# Altium project 20K Control Board V1.1.PrjPCB (part 3 of 6)

## Sheet Driver.SchDoc
size A2
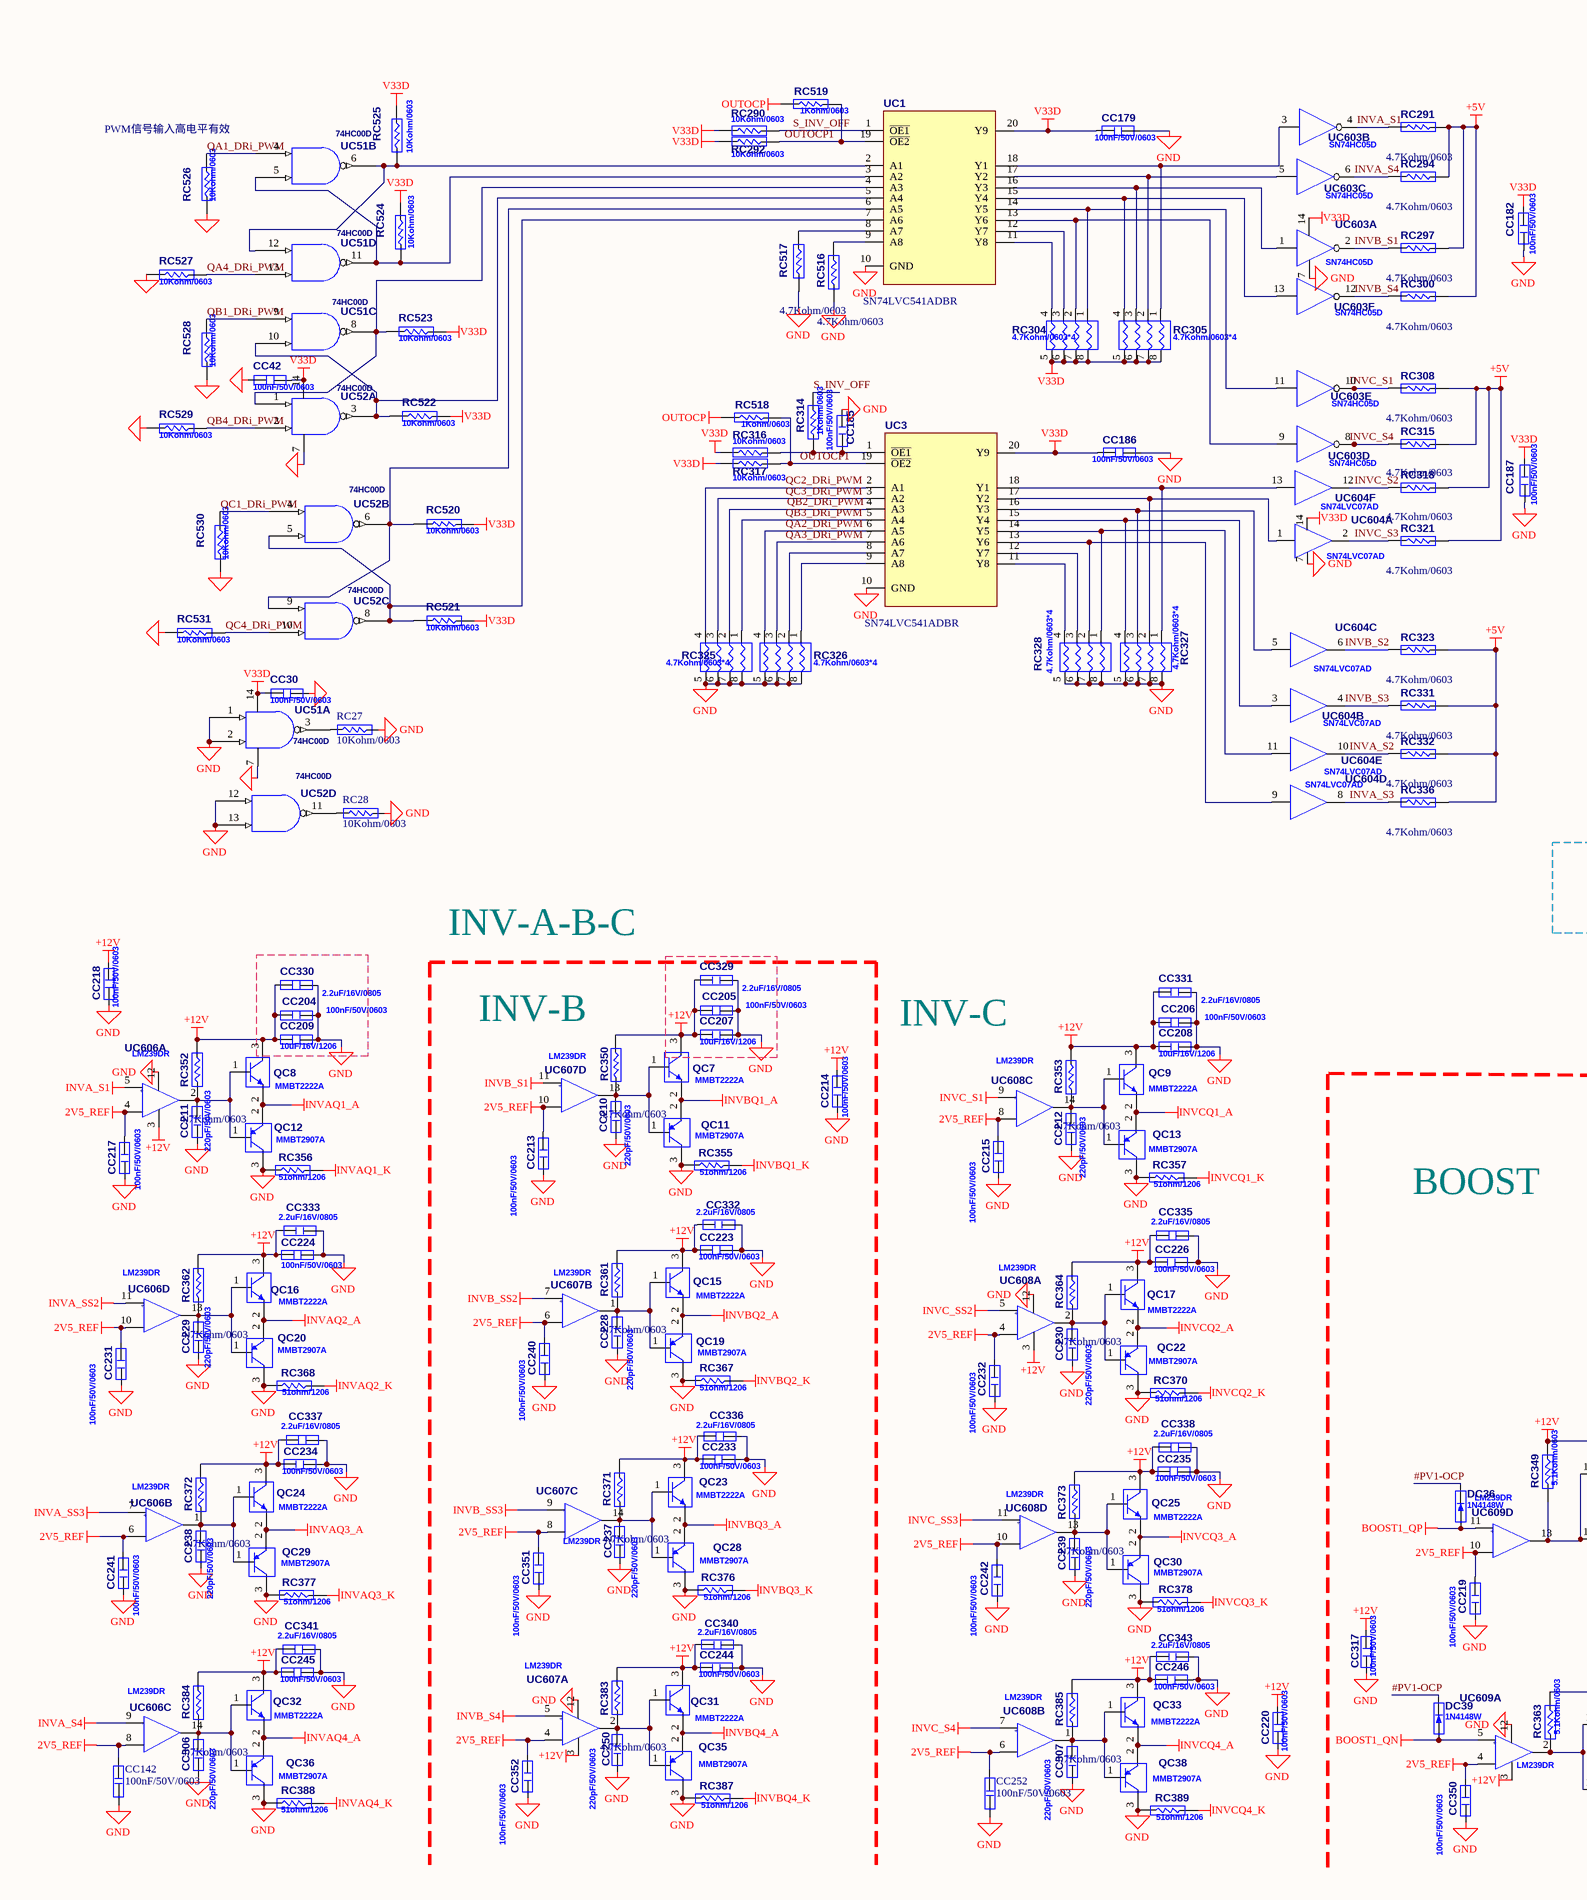
[diagram p3: Driver.SchDoc, left]
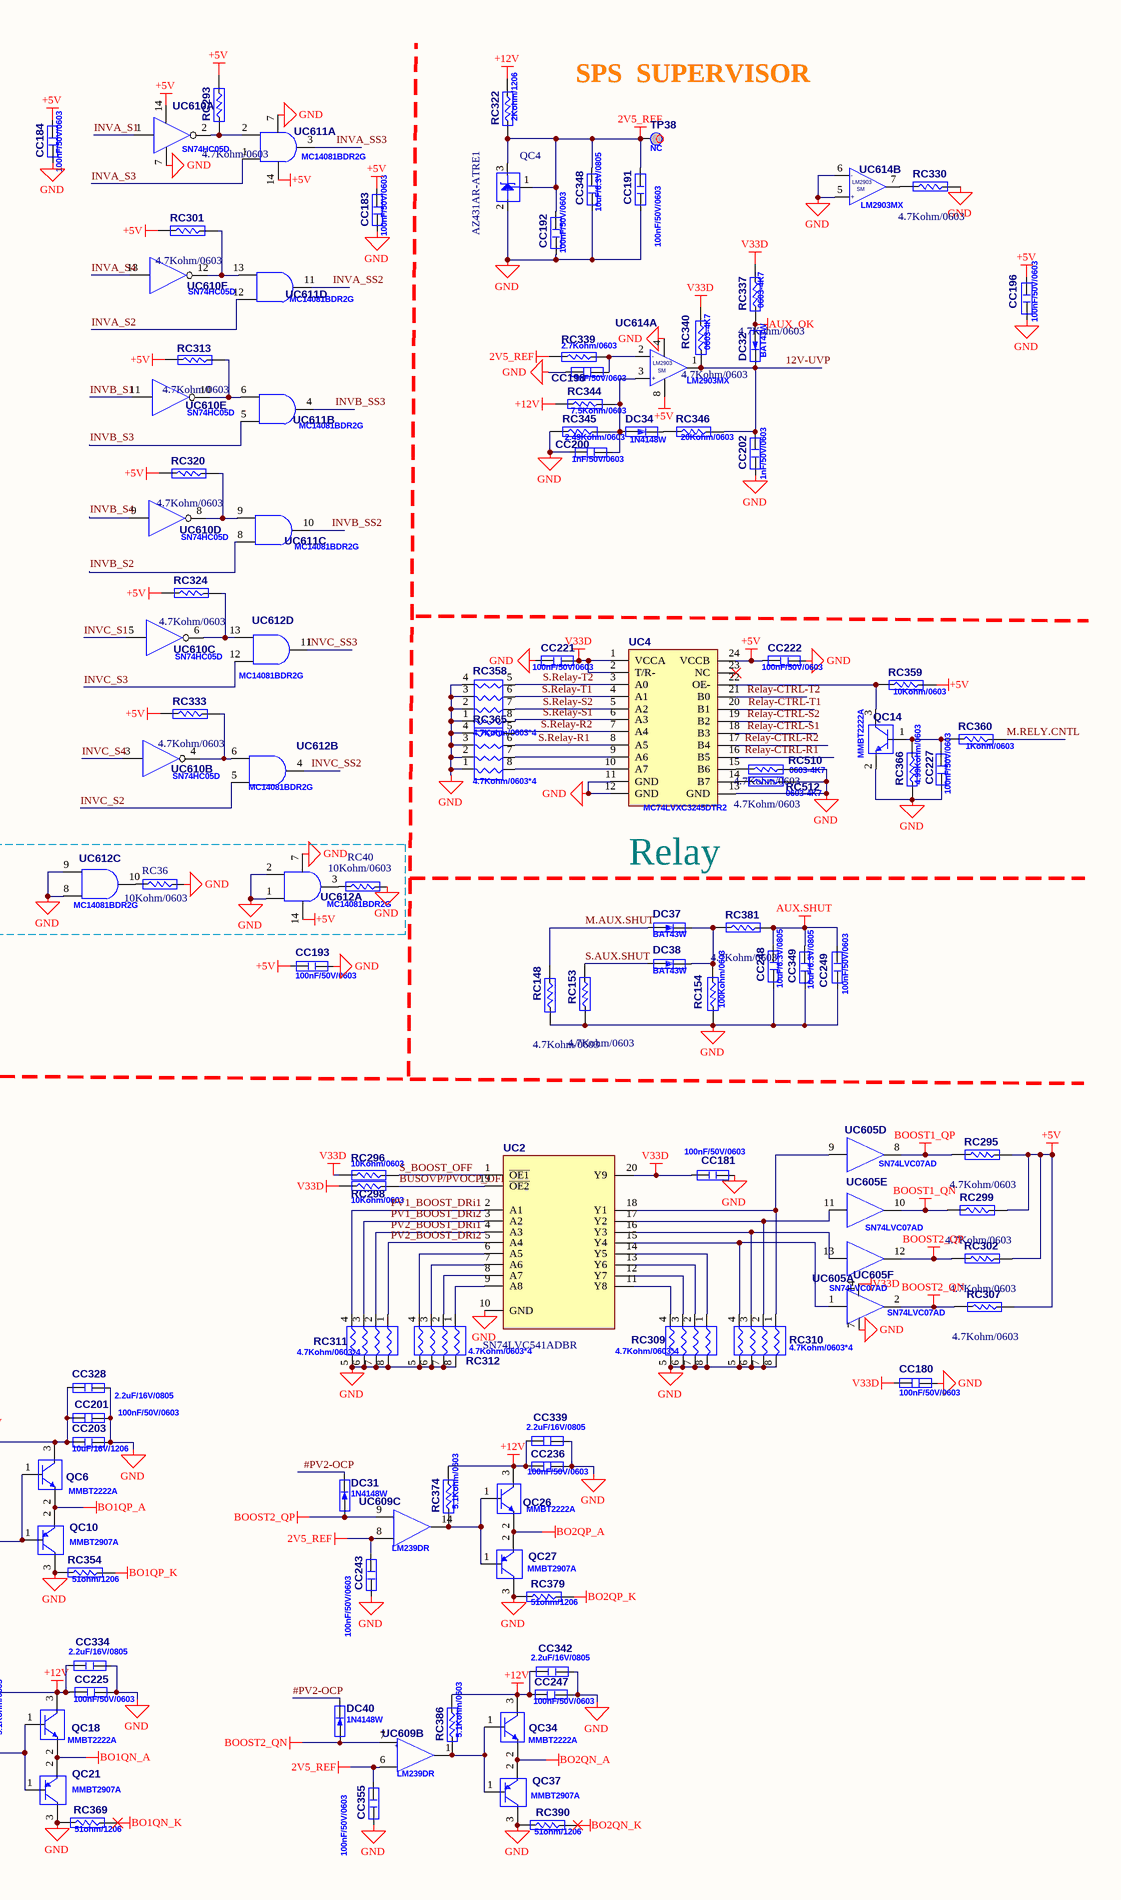
[diagram p4: Driver.SchDoc, right]

### Parts
CC30  value 100nF/50V/0603  [CC1608-0603]  (hidden comment: 023-105220-0)
CC42  value 100nF/50V/0603  [CC1608-0603]  (hidden comment: 023-105220-0)
CC142  value 100nF/50V/0603  [C0603SM]  (hidden comment: 023-105220-0)
CC179  value 100nF/50V/0603  [CC1608-0603]  (hidden comment: 023-105220-0)
CC180  value 100nF/50V/0603  [CC1608-0603]  (hidden comment: 023-105220-0)
CC181  value 100nF/50V/0603  [CC1608-0603]  (hidden comment: 023-105220-0)
CC182  value 100nF/50V/0603  [CC1608-0603]  (hidden comment: 023-105220-0)
CC183  value 100nF/50V/0603  [CC1608-0603]  (hidden comment: 023-105220-0)
CC184  value 100nF/50V/0603  [CC1608-0603]  (hidden comment: 023-105220-0)
CC185  value 100nF/50V/0603  [CC1608-0603]  (hidden comment: 023-105220-0)
CC186  value 100nF/50V/0603  [CC1608-0603]  (hidden comment: 023-105220-0)
CC187  value 100nF/50V/0603  [CC1608-0603]  (hidden comment: 023-105220-0)
CC191  value 100nF/50V/0603  [CC1608-0603]  (hidden comment: 023-105220-0)
CC192  value 100nF/50V/0603  [CC1608-0603]  (hidden comment: 023-105220-0)
CC193  value 100nF/50V/0603  [CC1608-0603]  (hidden comment: 023-105220-0)
CC196  value 100nF/50V/0603  [CC1608-0603]  (hidden comment: 023-105220-0)
CC198  value 1nF/50V/0603  [CC1608-0603]  (hidden comment: 023-102220-0)
CC200  value 1nF/50V/0603  [CC1608-0603]  (hidden comment: 023-102220-0)
CC201  value 100nF/50V/0603  [CC1608-0603]  (hidden comment: 023-105220-0)
CC202  value 1nF/50V/0603  [CC1608-0603]  (hidden comment: 023-102220-0)
CC203  value 10uF/16V/1206  [CC3216-1206]  (hidden comment: 023-106350-0)
CC204  value 100nF/50V/0603  [CC1608-0603]  (hidden comment: 023-105220-0)
CC205  value 100nF/50V/0603  [CC1608-0603]  (hidden comment: 023-105220-0)
CC206  value 100nF/50V/0603  [CC1608-0603]  (hidden comment: 023-105220-0)
CC207  value 10uF/16V/1206  [CC3216-1206]  (hidden comment: 023-106350-0)
CC208  value 10uF/16V/1206  [CC3216-1206]  (hidden comment: 023-106350-0)
CC209  value 10uF/16V/1206  [CC3216-1206]  (hidden comment: 023-106350-0)
CC210  value 220pF/50V/0603  [CC1608-0603]  (hidden comment: 023-221220-0)
CC211  value 220pF/50V/0603  [CC1608-0603]  (hidden comment: 023-221220-0)
CC212  value 220pF/50V/0603  [CC1608-0603]  (hidden comment: 023-221220-0)
CC213  value 100nF/50V/0603  [CC1608-0603]  (hidden comment: 023-105220-0)
CC214  value 100nF/50V/0603  [CC1608-0603]  (hidden comment: 023-105220-0)
CC215  value 100nF/50V/0603  [CC1608-0603]  (hidden comment: 023-105220-0)
CC217  value 100nF/50V/0603  [CC1608-0603]  (hidden comment: 023-105220-0)
CC218  value 100nF/50V/0603  [CC1608-0603]  (hidden comment: 023-105220-0)
CC219  value 100nF/50V/0603  [CC1608-0603]  (hidden comment: 023-105220-0)
CC220  value 100nF/50V/0603  [CC1608-0603]  (hidden comment: 023-105220-0)
CC221  value 100nF/50V/0603  [CC1608-0603]  (hidden comment: 023-105220-0)
CC222  value 100nF/50V/0603  [CC1608-0603]  (hidden comment: 023-105220-0)
CC223  value 100nF/50V/0603  [CC1608-0603]  (hidden comment: 023-105220-0)
CC224  value 100nF/50V/0603  [CC1608-0603]  (hidden comment: 023-105220-0)
CC225  value 100nF/50V/0603  [CC1608-0603]  (hidden comment: 023-105220-0)
CC226  value 100nF/50V/0603  [CC1608-0603]  (hidden comment: 023-105220-0)
CC227  value 100nF/50V/0603  [CC1608-0603]  (hidden comment: 023-105220-0)
CC228  value 220pF/50V/0603  [CC1608-0603]  (hidden comment: 023-221220-0)
CC229  value 220pF/50V/0603  [CC1608-0603]  (hidden comment: 023-221220-0)
CC230  value 220pF/50V/0603  [CC1608-0603]  (hidden comment: 023-221220-0)
CC231  value 100nF/50V/0603  [CC1608-0603]  (hidden comment: 023-105220-0)
CC232  value 100nF/50V/0603  [CC1608-0603]  (hidden comment: 023-105220-0)
CC233  value 100nF/50V/0603  [CC1608-0603]  (hidden comment: 023-105220-0)
CC234  value 100nF/50V/0603  [CC1608-0603]  (hidden comment: 023-105220-0)
CC235  value 100nF/50V/0603  [CC1608-0603]  (hidden comment: 023-105220-0)
CC236  value 100nF/50V/0603  [CC1608-0603]  (hidden comment: 023-105220-0)
CC237  value 220pF/50V/0603  [CC1608-0603]  (hidden comment: 023-221220-0)
CC238  value 220pF/50V/0603  [CC1608-0603]  (hidden comment: 023-221220-0)
CC239  value 220pF/50V/0603  [CC1608-0603]  (hidden comment: 023-221220-0)
CC240  value 100nF/50V/0603  [CC1608-0603]  (hidden comment: 023-105220-0)
CC241  value 100nF/50V/0603  [CC1608-0603]  (hidden comment: 023-105220-0)
CC242  value 100nF/50V/0603  [CC1608-0603]  (hidden comment: 023-105220-0)
CC243  value 100nF/50V/0603  [CC1608-0603]  (hidden comment: 023-105220-0)
CC244  value 100nF/50V/0603  [CC1608-0603]  (hidden comment: 023-105220-0)
CC245  value 100nF/50V/0603  [CC1608-0603]  (hidden comment: 023-105220-0)
CC246  value 100nF/50V/0603  [CC1608-0603]  (hidden comment: 023-105220-0)
CC247  value 100nF/50V/0603  [CC1608-0603]  (hidden comment: 023-105220-0)
CC248  value 10uF/6.3V/0805  [CC2012-0805]  (hidden comment: 023-106330-0)
CC249  value 100nF/50V/0603  [CC1608-0603]  (hidden comment: 023-105220-0)
CC250  value 220pF/50V/0603  [CC1608-0603]  (hidden comment: 023-221220-0)
CC252  value 100nF/50V/0603  [C0603SM]  (hidden comment: 023-105220-0)
CC306  value 220pF/50V/0603  [CC1608-0603]  (hidden comment: 023-221220-0)
CC307  value 220pF/50V/0603  [CC1608-0603]  (hidden comment: 023-221220-0)
CC317  value 100nF/50V/0603  [CC1608-0603]  (hidden comment: 023-105220-0)
CC328  value 2.2uF/16V/0805  [CC2012-0805]  (hidden comment: 023-225330-0)
CC329  value 2.2uF/16V/0805  [CC2012-0805]  (hidden comment: 023-225330-0)
CC330  value 2.2uF/16V/0805  [CC2012-0805]  (hidden comment: 023-225330-0)
CC331  value 2.2uF/16V/0805  [CC2012-0805]  (hidden comment: 023-225330-0)
CC332  value 2.2uF/16V/0805  [CC2012-0805]  (hidden comment: 023-225330-0)
CC333  value 2.2uF/16V/0805  [CC2012-0805]  (hidden comment: 023-225330-0)
CC334  value 2.2uF/16V/0805  [CC2012-0805]  (hidden comment: 023-225330-0)
CC335  value 2.2uF/16V/0805  [CC2012-0805]  (hidden comment: 023-225330-0)
CC336  value 2.2uF/16V/0805  [CC2012-0805]  (hidden comment: 023-225330-0)
CC337  value 2.2uF/16V/0805  [CC2012-0805]  (hidden comment: 023-225330-0)
CC338  value 2.2uF/16V/0805  [CC2012-0805]  (hidden comment: 023-225330-0)
CC339  value 2.2uF/16V/0805  [CC2012-0805]  (hidden comment: 023-225330-0)
CC340  value 2.2uF/16V/0805  [CC2012-0805]  (hidden comment: 023-225330-0)
CC341  value 2.2uF/16V/0805  [CC2012-0805]  (hidden comment: 023-225330-0)
CC342  value 2.2uF/16V/0805  [CC2012-0805]  (hidden comment: 023-225330-0)
CC343  value 2.2uF/16V/0805  [CC2012-0805]  (hidden comment: 023-225330-0)
CC348  value 10uF/6.3V/0805  [CC2012-0805]  (hidden comment: 023-106330-0)
CC349  value 10uF/6.3V/0805  [CC2012-0805]  (hidden comment: 023-106330-0)
CC350  value 100nF/50V/0603  [CC1608-0603]  (hidden comment: 023-105220-0)
CC351  value 100nF/50V/0603  [CC1608-0603]  (hidden comment: 023-105220-0)
CC352  value 100nF/50V/0603  [CC1608-0603]  (hidden comment: 023-105220-0)
CC355  value 100nF/50V/0603  [CC1608-0603]  (hidden comment: 023-105220-0)
DC31  value 1N4148W  [SOD-123]  (hidden comment: 060-500010-0)
DC32  value BAT43W  [SOD-123]  (hidden comment: 060-310000-0)
DC34  value 1N4148W  [SOD-123]  (hidden comment: 060-500010-0)
DC36  value 1N4148W  [SOD-123]  (hidden comment: 060-500010-0)
DC37  value BAT43W  [SOD-123]  (hidden comment: 060-310000-0)
DC38  value BAT43W  [SOD-123]  (hidden comment: 060-310000-0)
DC39  value 1N4148W  [SOD-123]  (hidden comment: 060-500010-0)
DC40  value 1N4148W  [SOD-123]  (hidden comment: 060-500010-0)
QC4  value AZ431AR-ATRE1  [SOT89]  (hidden comment: 050-210020-0)
QC6  value MMBT2222A  [SOT-23]  (hidden comment: 061-010000-0)
QC7  value MMBT2222A  [SOT-23]  (hidden comment: 061-010000-0)
QC8  value MMBT2222A  [SOT-23]  (hidden comment: 061-010000-0)
QC9  value MMBT2222A  [SOT-23]  (hidden comment: 061-010000-0)
QC10  value MMBT2907A  [SOT-23]  (hidden comment: 061-110000-0)
QC11  value MMBT2907A  [SOT-23]  (hidden comment: 061-110000-0)
QC12  value MMBT2907A  [SOT-23]  (hidden comment: 061-110000-0)
QC13  value MMBT2907A  [SOT-23]  (hidden comment: 061-110000-0)
QC14  value MMBT2222A  [SOT-23]  (hidden comment: 061-010000-0)
QC15  value MMBT2222A  [SOT-23]  (hidden comment: 061-010000-0)
QC16  value MMBT2222A  [SOT-23]  (hidden comment: 061-010000-0)
QC17  value MMBT2222A  [SOT-23]  (hidden comment: 061-010000-0)
QC18  value MMBT2222A  [SOT-23]  (hidden comment: 061-010000-0)
QC19  value MMBT2907A  [SOT-23]  (hidden comment: 061-110000-0)
QC20  value MMBT2907A  [SOT-23]  (hidden comment: 061-110000-0)
QC21  value MMBT2907A  [SOT-23]  (hidden comment: 061-110000-0)
QC22  value MMBT2907A  [SOT-23]  (hidden comment: 061-110000-0)
QC23  value MMBT2222A  [SOT-23]  (hidden comment: 061-010000-0)
QC24  value MMBT2222A  [SOT-23]  (hidden comment: 061-010000-0)
QC25  value MMBT2222A  [SOT-23]  (hidden comment: 061-010000-0)
QC26  value MMBT2222A  [SOT-23]  (hidden comment: 061-010000-0)
QC27  value MMBT2907A  [SOT-23]  (hidden comment: 061-110000-0)
QC28  value MMBT2907A  [SOT-23]  (hidden comment: 061-110000-0)
QC29  value MMBT2907A  [SOT-23]  (hidden comment: 061-110000-0)
QC30  value MMBT2907A  [SOT-23]  (hidden comment: 061-110000-0)
QC31  value MMBT2222A  [SOT-23]  (hidden comment: 061-010000-0)
QC32  value MMBT2222A  [SOT-23]  (hidden comment: 061-010000-0)
QC33  value MMBT2222A  [SOT-23]  (hidden comment: 061-010000-0)
QC34  value MMBT2222A  [SOT-23]  (hidden comment: 061-010000-0)
QC35  value MMBT2907A  [SOT-23]  (hidden comment: 061-110000-0)
QC36  value MMBT2907A  [SOT-23]  (hidden comment: 061-110000-0)
QC37  value MMBT2907A  [SOT-23]  (hidden comment: 061-110000-0)
QC38  value MMBT2907A  [SOT-23]  (hidden comment: 061-110000-0)
RC27  value 10Kohm/0603  [R0603SM]  (hidden comment: 011-103020-0)
RC28  value 10Kohm/0603  [R0603SM]  (hidden comment: 011-103020-0)
RC36  value 10Kohm/0603  [R0603SM]  (hidden comment: 011-103020-0)
RC40  value 10Kohm/0603  [R0603SM]  (hidden comment: 011-103020-0)
RC148  value 4.7Kohm/0603  [R1608-0603]  (hidden comment: 011-472020-0)
RC153  value 4.7Kohm/0603  [R1608-0603]  (hidden comment: 011-472020-0)
RC154  value 100Kohm/0603  [R1608-0603]  (hidden comment: 011-104020-0)
RC290  value 10Kohm/0603  [R1608-0603]  (hidden comment: 011-103020-0)
RC291  value 4.7Kohm/0603  [R1608-0603]  (hidden comment: 011-472020-0)
RC292  value 10Kohm/0603  [R1608-0603]  (hidden comment: 011-103020-0)
RC293  value 4.7Kohm/0603  [R1608-0603]  (hidden comment: 011-472020-0)
RC294  value 4.7Kohm/0603  [R1608-0603]  (hidden comment: 011-472020-0)
RC295  value 4.7Kohm/0603  [R1608-0603]  (hidden comment: 011-472020-0)
RC296  value 10Kohm/0603  [R1608-0603]  (hidden comment: 011-103020-0)
RC297  value 4.7Kohm/0603  [R1608-0603]  (hidden comment: 011-472020-0)
RC298  value 10Kohm/0603  [R1608-0603]  (hidden comment: 011-103020-0)
RC299  value 4.7Kohm/0603  [R1608-0603]  (hidden comment: 011-472020-0)
RC300  value 4.7Kohm/0603  [R1608-0603]  (hidden comment: 011-472020-0)
RC301  value 4.7Kohm/0603  [R1608-0603]  (hidden comment: 011-472020-0)
RC302  value 4.7Kohm/0603  [R1608-0603]  (hidden comment: 011-472020-0)
RC304  value 4.7Kohm/0603*4  [RN0603*4]  (hidden comment: 019-472000-0)
RC305  value 4.7Kohm/0603*4  [RN0603*4]  (hidden comment: 019-472000-0)
RC307  value 4.7Kohm/0603  [R1608-0603]  (hidden comment: 011-472020-0)
RC308  value 4.7Kohm/0603  [R1608-0603]  (hidden comment: 011-472020-0)
RC309  value 4.7Kohm/0603*4  [RN0603*4]  (hidden comment: 019-472000-0)
RC310  value 4.7Kohm/0603*4  [RN0603*4]  (hidden comment: 019-472000-0)
RC311  value 4.7Kohm/0603*4  [RN0603*4]  (hidden comment: 019-472000-0)
RC312  value 4.7Kohm/0603*4  [RN0603*4]  (hidden comment: 019-472000-0)
RC313  value 4.7Kohm/0603  [R1608-0603]  (hidden comment: 011-472020-0)
RC314  value 1Kohm/0603  [R1608-0603]  (hidden comment: 011-102020-0)
RC315  value 4.7Kohm/0603  [R1608-0603]  (hidden comment: 011-472020-0)
RC316  value 10Kohm/0603  [R1608-0603]  (hidden comment: 011-103020-0)
RC317  value 10Kohm/0603  [R1608-0603]  (hidden comment: 011-103020-0)
RC318  value 4.7Kohm/0603  [R1608-0603]  (hidden comment: 011-472020-0)
RC320  value 4.7Kohm/0603  [R1608-0603]  (hidden comment: 011-472020-0)
RC321  value 4.7Kohm/0603  [R1608-0603]  (hidden comment: 011-472020-0)
RC322  value 2Kohm/1206  [R3216-1206]  (hidden comment: 011-202050-0)
RC323  value 4.7Kohm/0603  [R1608-0603]  (hidden comment: 011-472020-0)
RC324  value 4.7Kohm/0603  [R1608-0603]  (hidden comment: 011-472020-0)
RC325  value 4.7Kohm/0603*4  [RN0603*4]  (hidden comment: 019-472000-0)
RC326  value 4.7Kohm/0603*4  [RN0603*4]  (hidden comment: 019-472000-0)
RC327  value 4.7Kohm/0603*4  [RN0603*4]  (hidden comment: 019-472000-0)
RC328  value 4.7Kohm/0603*4  [RN0603*4]  (hidden comment: 019-472000-0)
RC330  value 4.7Kohm/0603  [R1608-0603]  (hidden comment: 011-472020-0)
RC331  value 4.7Kohm/0603  [R1608-0603]  (hidden comment: 011-472020-0)
RC332  value 4.7Kohm/0603  [R1608-0603]  (hidden comment: 011-472020-0)
RC333  value 4.7Kohm/0603  [R1608-0603]  (hidden comment: 011-472020-0)
RC336  value 4.7Kohm/0603  [R1608-0603]  (hidden comment: 011-472020-0)
RC337  value 4.7Kohm/0603  Type: 0603-4K7  [R1608-0603]  (hidden comment: 011-472020-0)
RC339  value 2.7Kohm/0603  [R1608-0603]  (hidden comment: 011-272020-0)
RC340  value 4.7Kohm/0603  Type: 0603-4K7  [R1608-0603]  (hidden comment: 011-472020-0)
RC344  value 7.5Kohm/0603  [R1608-0603]  (hidden comment: 011-752020-0)
RC345  value 2.49Kohm/0603  [R1608-0603]  (hidden comment: 011-242020-0)
RC346  value 20Kohm/0603  [R1608-0603]  (hidden comment: 011-203020-0)
RC349  value 5.1Kohm/0603  [R1608-0603]  (hidden comment: 011-512020-0)
RC350  value 4.7Kohm/0603  [R1608-0603]  (hidden comment: 011-472020-0)
RC352  value 4.7Kohm/0603  [R1608-0603]  (hidden comment: 011-472020-0)
RC353  value 4.7Kohm/0603  [R1608-0603]  (hidden comment: 011-472020-0)
RC354  value 51ohm/1206  [R3216-1206]  (hidden comment: 011-510050-0)
RC355  value 51ohm/1206  [R3216-1206]  (hidden comment: 011-510050-0)
RC356  value 51ohm/1206  [R3216-1206]  (hidden comment: 011-510050-0)
RC357  value 51ohm/1206  [R3216-1206]  (hidden comment: 011-510050-0)
RC358  value 4.7Kohm/0603*4  [RN0603*4]  (hidden comment: 019-472000-0)
RC359  value 10Kohm/0603  [R1608-0603]  (hidden comment: 011-103020-0)
RC360  value 1Kohm/0603  [R1608-0603]  (hidden comment: 011-102020-0)
RC361  value 4.7Kohm/0603  [R1608-0603]  (hidden comment: 011-472020-0)
RC362  value 4.7Kohm/0603  [R1608-0603]  (hidden comment: 011-472020-0)
RC363  value 5.1Kohm/0603  [R1608-0603]  (hidden comment: 011-512020-0)
RC364  value 4.7Kohm/0603  [R1608-0603]  (hidden comment: 011-472020-0)
RC365  value 4.7Kohm/0603*4  [RN0603*4]  (hidden comment: 019-472000-0)
RC366  value 4.99Kohm/0603  [R1608-0603]  (hidden comment: 011-492020-0)
RC367  value 51ohm/1206  [R3216-1206]  (hidden comment: 011-510050-0)
RC368  value 51ohm/1206  [R3216-1206]  (hidden comment: 011-510050-0)
RC369  value 51ohm/1206  [R3216-1206]  (hidden comment: 011-510050-0)
RC370  value 51ohm/1206  [R3216-1206]  (hidden comment: 011-510050-0)
RC371  value 4.7Kohm/0603  [R1608-0603]  (hidden comment: 011-472020-0)
RC372  value 4.7Kohm/0603  [R1608-0603]  (hidden comment: 011-472020-0)
RC373  value 4.7Kohm/0603  [R1608-0603]  (hidden comment: 011-472020-0)
RC374  value 5.1Kohm/0603  [R1608-0603]  (hidden comment: 011-512020-0)
RC376  value 51ohm/1206  [R3216-1206]  (hidden comment: 011-510050-0)
RC377  value 51ohm/1206  [R3216-1206]  (hidden comment: 011-510050-0)
RC378  value 51ohm/1206  [R3216-1206]  (hidden comment: 011-510050-0)
RC379  value 51ohm/1206  [R3216-1206]  (hidden comment: 011-510050-0)
RC381  value 4.7Kohm/0603  [R1608-0603]  (hidden comment: 011-472020-0)
RC383  value 4.7Kohm/0603  [R1608-0603]  (hidden comment: 011-472020-0)
RC384  value 4.7Kohm/0603  [R1608-0603]  (hidden comment: 011-472020-0)
RC385  value 4.7Kohm/0603  [R1608-0603]  (hidden comment: 011-472020-0)
RC386  value 5.1Kohm/0603  [R1608-0603]  (hidden comment: 011-512020-0)
RC387  value 51ohm/1206  [R3216-1206]  (hidden comment: 011-510050-0)
RC388  value 51ohm/1206  [R3216-1206]  (hidden comment: 011-510050-0)
RC389  value 51ohm/1206  [R3216-1206]  (hidden comment: 011-510050-0)
RC390  value 51ohm/1206  [R3216-1206]  (hidden comment: 011-510050-0)
RC510  value 4.7Kohm/0603  Type: 0603-4K7  [R1608-0603]  (hidden comment: 011-472020-0)
RC512  value 4.7Kohm/0603  Type: 0603-4K7  [R1608-0603]  (hidden comment: 011-472020-0)
RC516  value 4.7Kohm/0603  [R1608-0603]  (hidden comment: 011-472020-0)
RC517  value 4.7Kohm/0603  [R1608-0603]  (hidden comment: 011-472020-0)
RC518  value 1Kohm/0603  [R1608-0603]  (hidden comment: 011-102020-0)
RC519  value 1Kohm/0603  [R1608-0603]  (hidden comment: 011-102020-0)
RC520  value 10Kohm/0603  [R1608-0603]  (hidden comment: 011-103020-0)
RC521  value 10Kohm/0603  [R1608-0603]  (hidden comment: 011-103020-0)
RC522  value 10Kohm/0603  [R1608-0603]  (hidden comment: 011-103020-0)
RC523  value 10Kohm/0603  [R1608-0603]  (hidden comment: 011-103020-0)
RC524  value 10Kohm/0603  [R1608-0603]  (hidden comment: 011-103020-0)
RC525  value 10Kohm/0603  [R1608-0603]  (hidden comment: 011-103020-0)
RC526  value 10Kohm/0603  [R1608-0603]  (hidden comment: 011-103020-0)
RC527  value 10Kohm/0603  [R1608-0603]  (hidden comment: 011-103020-0)
RC528  value 10Kohm/0603  [R1608-0603]  (hidden comment: 011-103020-0)
RC529  value 10Kohm/0603  [R1608-0603]  (hidden comment: 011-103020-0)
RC530  value 10Kohm/0603  [R1608-0603]  (hidden comment: 011-103020-0)
RC531  value 10Kohm/0603  [R1608-0603]  (hidden comment: 011-103020-0)
TP38  NC  [TEST-12]
UC1  value SN74LVC541ADBR  [SSOP-20]  (hidden comment: 050-510030-0)
UC2  value SN74LVC541ADBR  [SSOP-20]  (hidden comment: 050-510030-0)
UC3  value SN74LVC541ADBR  [SSOP-20]  (hidden comment: 050-510030-0)
UC4  value MC74LVXC3245DTR2  [TSOP-24]  (hidden comment: 050-510040-0)
UC51  value 74HC00D  [SO14]  (hidden comment: 050-510021-0)  (parts A,B,C,D of 4)
UC52  value 74HC00D  [SO14]  (hidden comment: 050-510021-0)  (parts A,B,C,D of 4)
UC603  value SN74HC05D  [SO14]  (hidden comment: 050-610311-0)  (parts A,B,C,D,E,F of 6)
UC604  value SN74LVC07AD  [SO14]  (hidden comment: 050-510011-0)  (parts A,B,C,D,E,F of 6)
UC605  value SN74LVC07AD  [SO14]  (hidden comment: 050-510011-0)  (parts A,D,E,F of 6)
UC606  value LM239DR  [SO14]  (hidden comment: 050-610030-0)  (parts A,B,C,D of 4)
UC607  value LM239DR  [SO14]  (hidden comment: 050-610030-0)  (parts A,B,C,D of 4)
UC608  value LM239DR  [SO14]  (hidden comment: 050-610030-0)  (parts A,B,C,D of 4)
UC609  value LM239DR  [SO14]  (hidden comment: 050-610030-0)  (parts A,B,C,D of 4)
UC610  value SN74HC05D  [SO14]  (hidden comment: 050-610311-0)  (parts A,B,C,D,E,F of 6)
UC611  value MC14081BDR2G  [SO14]  (hidden comment: 050-510230-0)  (parts A,B,C,D of 4)
UC612  value MC14081BDR2G  [SO14]  (hidden comment: 050-510230-0)  (parts A,B,C,D of 4)
UC614  value LM2903MX  [SO8]  (hidden comment: 050-610040-0)  (parts A,B of 2)

### Nets
2V5_REF: CC142.2 CC191.1 CC192.1 CC213.1 CC215.1 CC217.2 CC219.1 CC231.1 CC232.1 CC240.1 CC241.1 CC242.1 CC243.1 CC252.2 CC348.2 CC350.1 CC351.1 CC352.1 CC355.1 QC4.1(R) QC4.3(C) RC322.1 RC339.1 TP38.1 UC606.4 UC606.6 UC606.8 UC606.10 UC607.4 UC607.6 UC607.8 UC607.10 UC608.4 UC608.6 UC608.8 UC608.10 UC609.4 UC609.6 UC609.8 UC609.10
+5V: CC183.1 CC184.1 CC193.1 CC196.1 CC222.2 RC291.2 RC293.2 RC294.2 RC295.2 RC297.2 RC299.2 RC300.2 RC301.2 RC302.2 RC307.2 RC308.2 RC313.2 RC315.2 RC318.2 RC320.2 RC321.2 RC323.2 RC324.2 RC331.2 RC332.2 RC333.2 RC336.2 RC359.2 UC4.24(VCCB) UC610.14 UC611.14 UC612.14 UC614.8
+12V: CC201.1 CC203.1 CC204.1 CC205.1 CC206.1 CC207.1 CC208.1 CC209.1 CC214.2 CC218.2 CC220.2 CC223.1 CC224.1 CC225.1 CC226.1 CC233.1 CC234.1 CC235.1 CC236.1 CC244.1 CC245.1 CC246.1 CC247.1 CC317.1 CC328.1 CC329.1 CC330.1 CC331.1 CC332.1 CC333.1 CC334.1 CC335.1 CC336.1 CC337.1 CC338.1 CC339.1 CC340.1 CC341.1 CC342.1 CC343.1 QC6.3 QC7.3 QC8.3 QC9.3 QC15.3 QC16.3 QC17.3 QC18.3 QC23.3 QC24.3 QC25.3 QC26.3 QC31.3 QC32.3 QC33.3 QC34.3 RC322.2 RC344.2 RC349.2 RC350.2 RC352.2 RC353.2 RC361.2 RC362.2 RC363.2 RC364.2 RC371.2 RC372.2 RC373.2 RC374.2 RC383.2 RC384.2 RC385.2 RC386.2 UC606.3 UC607.3 UC608.3 UC609.3
AUX.SHUT: CC248.2 CC249.2 CC349.2 RC381.1
AUX_OK: DC32.1(A) RC337.1
BO1QN_A: QC18.2 QC21.2
BO1QN_K: RC369.2
BO1QP_A: QC6.2 QC10.2
BO1QP_K: RC354.2
BO2QN_A: QC34.2 QC37.2
BO2QN_K: RC390.2
BO2QP_A: QC26.2 QC27.2
BO2QP_K: RC379.2
BOOST1_QN: DC39.1 RC299.1 UC605.10 UC609.5
BOOST1_QP: DC36.1 RC295.1 UC605.8 UC609.11
BOOST2_QN: DC40.1 RC307.1 UC605.2 UC609.7
BOOST2_QP: DC31.1 RC302.1 UC605.12 UC609.9
GND: CC30.1 CC42.2 CC142.1 CC179.2 CC180.2 CC181.2 CC182.2 CC183.2 CC184.2 CC185.2 CC186.2 CC187.2 CC191.2 CC192.2 CC193.2 CC196.2 CC198.1 CC200.1 CC201.2 CC202.1 CC203.2 CC204.2 CC205.2 CC206.2 CC207.2 CC208.2 CC209.2 CC210.1 CC211.1 CC212.1 CC213.2 CC214.1 CC215.2 CC217.1 CC218.1 CC219.2 CC220.1 CC221.2 CC222.1 CC223.2 CC224.2 CC225.2 CC226.2 CC227.2 CC228.1 CC229.1 CC230.1 CC231.2 CC232.2 CC233.2 CC234.2 CC235.2 CC236.2 CC237.1 CC238.1 CC239.1 CC240.2 CC241.2 CC242.2 CC243.2 CC244.2 CC245.2 CC246.2 CC247.2 CC248.1 CC249.1 CC250.1 CC252.1 CC306.1 CC307.1 CC317.2 CC328.2 CC329.2 CC330.2 CC331.2 CC332.2 CC333.2 CC334.2 CC335.2 CC336.2 CC337.2 CC338.2 CC339.2 CC340.2 CC341.2 CC342.2 CC343.2 CC348.1 CC349.1 CC350.2 CC351.2 CC352.2 CC355.2 QC4.2(A) QC10.3 QC11.3 QC12.3 QC13.3 QC14.2 QC19.3 QC20.3 QC21.3 QC22.3 QC27.3 QC28.3 QC29.3 QC30.3 QC35.3 QC36.3 QC37.3 QC38.3 RC27.2 RC28.2 RC36.2 RC40.2 RC148.1 RC153.1 RC154.1 RC309.5 RC309.6 RC309.7 RC309.8 RC310.5 RC310.6 RC310.7 RC310.8 RC311.5 RC311.6 RC311.7 RC311.8 RC312.5 RC312.6 RC312.7 RC312.8 RC325.5 RC325.6 RC325.7 RC325.8 RC326.5 RC326.6 RC326.7 RC326.8 RC327.5 RC327.6 RC327.7 RC327.8 RC328.5 RC328.6 RC328.7 RC328.8 RC330.1 RC345.2 RC354.1 RC355.1 RC356.1 RC357.1 RC358.1 RC358.2 RC358.3 RC358.4 RC365.1 RC365.2 RC365.3 RC365.4 RC366.1 RC367.1 RC368.1 RC369.1 RC370.1 RC376.1 RC377.1 RC378.1 RC379.1 RC387.1 RC388.1 RC389.1 RC390.1 RC510.1 RC512.1 RC516.1 RC517.1 RC526.1 RC527.1 RC528.1 RC529.1 RC530.1 RC531.1 UC1.10(GND) UC2.10(GND) UC3.10(GND) UC4.11(GND) UC4.12(GND) UC4.13(GND) UC51.1 UC51.2 UC51.7(GND) UC52.7(GND) UC52.12 UC52.13 UC603.7 UC604.7 UC605.7 UC606.12 UC607.12 UC608.12 UC609.12 UC610.7 UC611.7 UC612.1 UC612.2 UC612.7 UC612.8 UC612.9 UC614.4 UC614.5 UC614.6
INVA_S1: RC291.1 UC603.4 UC606.5 UC610.1
INVA_S4: RC294.1 UC603.6 UC606.9 UC610.13
INVA_SS2: UC606.11 UC611.11
INVA_SS3: UC606.7 UC611.3
INVAQ1_A: QC8.2 QC12.2
INVAQ1_K: RC356.2
INVAQ2_A: QC16.2 QC20.2
INVAQ2_K: RC368.2
INVAQ3_A: QC24.2 QC29.2
INVAQ3_K: RC377.2
INVAQ4_A: QC32.2 QC36.2
INVAQ4_K: RC388.2
INVB_S1: RC297.1 UC603.2 UC607.11 UC610.11
INVB_S4: RC300.1 UC603.12 UC607.5 UC610.9
INVB_SS2: UC607.7 UC611.10
INVB_SS3: UC607.9 UC611.4
INVBQ1_A: QC7.2 QC11.2
INVBQ1_K: RC355.2
INVBQ2_A: QC15.2 QC19.2
INVBQ2_K: RC367.2
INVBQ3_A: QC23.2 QC28.2
INVBQ3_K: RC376.2
INVBQ4_A: QC31.2 QC35.2
INVBQ4_K: RC387.2
INVC_S1: RC308.1 UC603.10 UC608.9 UC610.5
INVC_S4: RC315.1 UC603.8 UC608.7 UC610.3
INVC_SS2: UC608.5 UC612.4
INVC_SS3: UC608.11 UC612.11
INVCQ1_A: QC9.2 QC13.2
INVCQ1_K: RC357.2
INVCQ2_A: QC17.2 QC22.2
INVCQ2_K: RC370.2
INVCQ3_A: QC25.2 QC30.2
INVCQ3_K: RC378.2
INVCQ4_A: QC33.2 QC38.2
INVCQ4_K: RC389.2
OUTOCP: RC518.1 RC519.1
V33D: CC30.2 CC42.1 CC179.1 CC180.1 CC181.1 CC182.1 CC186.1 CC187.1 CC221.1 RC290.2 RC292.2 RC296.2 RC298.2 RC304.5 RC304.6 RC304.7 RC304.8 RC305.5 RC305.6 RC305.7 RC305.8 RC316.2 RC317.2 RC337.2 RC340.2 RC520.2 RC521.2 RC522.2 RC523.2 RC524.2 RC525.2 UC1.20(Y9) UC2.20(Y9) UC3.20(Y9) UC4.1(VCCA) UC4.2(T/R-) UC51.14(VCC) UC52.14(VCC) UC603.14 UC604.14 UC605.14
12V-UVP: CC202.2 DC32.2(K) RC340.1 RC346.2 UC614.1
#PV1-OCP: DC36.2 DC39.2
#PV2-OCP: DC31.2 DC40.2
BUSOVP/PVOCP_OFF: RC298.1 UC2.19(~{OE2})
INVA_S2: RC332.1 UC604.10 UC611.12
INVA_S3: RC336.1 UC604.8 UC611.1
INVB_S2: RC323.1 UC604.6 UC611.8
INVB_S3: RC331.1 UC604.4 UC611.5
INVC_S2: RC318.1 UC604.12 UC612.5
INVC_S3: RC321.1 UC604.2 UC612.12
M.AUX.SHUT: DC37.1(A) RC148.2
M.RELY.CNTL: RC360.2
OUTOCP1: RC292.1 RC317.1 RC518.2 RC519.2 UC1.19(~{OE2}) UC3.19(~{OE2})
PV1_BOOST_DRi1: RC311.4 UC2.2(A1)
PV1_BOOST_DRi2: RC311.3 UC2.3(A2)
PV2_BOOST_DRi1: RC311.2 UC2.4(A3)
PV2_BOOST_DRi2: RC311.1 UC2.5(A4)
QA1_DRi_PWM: RC526.2 UC51.4
QA2_DRi_PWM: RC326.4 UC3.6(A5)
QA3_DRi_PWM: RC326.3 UC3.7(A6)
QA4_DRi_PWM: RC527.2 UC51.13
QB1_DRi_PWM: RC528.2 UC51.9
QB2_DRi_PWM: RC325.2 UC3.4(A3)
QB3_DRi_PWM: RC325.1 UC3.5(A4)
QB4_DRi_PWM: RC529.2 UC52.2
QC1_DRi_PWM: RC530.2 UC52.4
QC2_DRi_PWM: RC325.4 UC3.2(A1)
QC3_DRi_PWM: RC325.3 UC3.3(A2)
QC4_DRi_PWM: RC531.2 UC52.10
Relay-CTRL-R1: UC4.16(B5)
Relay-CTRL-R2: UC4.17(B4)
Relay-CTRL-S1: UC4.18(B3)
Relay-CTRL-S2: UC4.19(B2)
Relay-CTRL-T1: UC4.20(B1)
Relay-CTRL-T2: UC4.21(B0)
S.AUX.SHUT: DC38.1(A) RC153.2
S.Relay-R1: RC365.6 UC4.8(A5)
S.Relay-R2: RC365.5 UC4.7(A4)
S.Relay-S1: RC358.8 UC4.6(A3)
S.Relay-S2: RC358.7 UC4.5(A2)
S.Relay-T1: RC358.6 UC4.4(A1)
S.Relay-T2: RC358.5 UC4.3(A0)
S_BOOST_OFF: RC296.1 UC2.1(~{OE1})
S_INV_OFF: RC290.1 RC314.2 UC1.1(~{OE1})
NetCC185_1: CC185.1 RC314.1 RC316.1 UC3.1(~{OE1})
NetCC198_2: CC198.2 RC339.2 UC614.2
NetCC200_2: CC200.2 DC34.1 RC344.1 RC345.1 UC614.3
NetCC210_2: CC210.2 QC7.1 QC11.1 RC350.1 UC607.13
NetCC211_2: CC211.2 QC8.1 QC12.1 RC352.1 UC606.2
NetCC212_2: CC212.2 QC9.1 QC13.1 RC353.1 UC608.14
NetCC227_1: CC227.1 QC14.1 RC360.1 RC366.2
NetCC228_2: CC228.2 QC15.1 QC19.1 RC361.1 UC607.1
NetCC229_2: CC229.2 QC16.1 QC20.1 RC362.1 UC606.13
NetCC230_2: CC230.2 QC17.1 QC22.1 RC364.1 UC608.2
NetCC237_2: CC237.2 QC23.1 QC28.1 RC371.1 UC607.14
NetCC238_2: CC238.2 QC24.1 QC29.1 RC372.1 UC606.1
NetCC239_2: CC239.2 QC25.1 QC30.1 RC373.1 UC608.13
NetCC250_2: CC250.2 QC31.1 QC35.1 RC383.1 UC607.2
NetCC306_2: CC306.2 QC32.1 QC36.1 RC384.1 UC606.14
NetCC307_2: CC307.2 QC33.1 QC38.1 RC385.1 UC608.1
NetDC34_2: DC34.2 RC346.1
NetDC37_2: DC37.2(K) DC38.2(K) RC154.2 RC381.2
NetQC6_1: QC6.1 QC10.1 RC349.1 UC609.13
NetQC14_3: QC14.3 RC359.1 UC4.22(OE-)
NetQC18_1: QC18.1 QC21.1 RC363.1 UC609.2
NetQC26_1: QC26.1 QC27.1 RC374.1 UC609.14
NetQC34_1: QC34.1 QC37.1 RC386.1 UC609.1
NetRC27_1: RC27.1 UC51.3
NetRC28_1: RC28.1 UC52.11
NetRC36_1: RC36.1 UC612.10
NetRC40_1: RC40.1 UC612.3
NetRC293_1: RC293.1 UC610.2 UC611.2
NetRC301_1: RC301.1 UC610.12 UC611.13
NetRC304_1: RC304.1 UC1.14(Y5) UC603.11
NetRC304_2: RC304.2 UC1.13(Y6) UC603.9
NetRC304_3: RC304.3 UC1.12(Y7)
NetRC304_4: RC304.4 UC1.11(Y8)
NetRC305_1: RC305.1 UC1.18(Y1) UC603.3
NetRC305_2: RC305.2 UC1.17(Y2) UC603.5
NetRC305_3: RC305.3 UC1.16(Y3) UC603.1
NetRC305_4: RC305.4 UC1.15(Y4) UC603.13
NetRC309_1: RC309.1 UC2.14(Y5)
NetRC309_2: RC309.2 UC2.13(Y6)
NetRC309_3: RC309.3 UC2.12(Y7)
NetRC309_4: RC309.4 UC2.11(Y8)
NetRC310_1: RC310.1 UC2.18(Y1) UC605.9
NetRC310_2: RC310.2 UC2.17(Y2) UC605.11
NetRC310_3: RC310.3 UC2.16(Y3) UC605.13
NetRC310_4: RC310.4 UC2.15(Y4) UC605.1
NetRC312_1: RC312.1 UC2.9(A8)
NetRC312_2: RC312.2 UC2.8(A7)
NetRC312_3: RC312.3 UC2.7(A6)
NetRC312_4: RC312.4 UC2.6(A5)
NetRC313_1: RC313.1 UC610.10 UC611.6
NetRC320_1: RC320.1 UC610.8 UC611.9
NetRC324_1: RC324.1 UC610.6 UC612.13
NetRC326_1: RC326.1 UC3.9(A8)
NetRC326_2: RC326.2 UC3.8(A7)
NetRC327_1: RC327.1 UC3.18(Y1) UC604.13
NetRC327_2: RC327.2 UC3.17(Y2) UC604.1
NetRC327_3: RC327.3 UC3.16(Y3) UC604.5
NetRC327_4: RC327.4 UC3.15(Y4) UC604.3
NetRC328_1: RC328.1 UC3.14(Y5) UC604.11
NetRC328_2: RC328.2 UC3.13(Y6) UC604.9
NetRC328_3: RC328.3 UC3.12(Y7)
NetRC328_4: RC328.4 UC3.11(Y8)
NetRC330_2: RC330.2 UC614.7
NetRC333_1: RC333.1 UC610.4 UC612.6
NetRC365_7: RC365.7 UC4.9(A6)
NetRC365_8: RC365.8 UC4.10(A7)
NetRC510_2: RC510.2 UC4.15(B6)
NetRC512_2: RC512.2 UC4.14(B7)
NetRC516_2: RC516.2 UC1.9(A8)
NetRC517_2: RC517.2 UC1.8(A7)
NetRC520_1: RC520.1 UC1.6(A5) UC52.6 UC52.9
NetRC521_1: RC521.1 UC1.7(A6) UC52.5 UC52.8
NetRC522_1: RC522.1 UC1.5(A4) UC51.10 UC52.3
NetRC523_1: RC523.1 UC1.4(A3) UC51.8 UC52.1
NetRC524_1: RC524.1 UC1.3(A2) UC51.5 UC51.11
NetRC525_1: RC525.1 UC1.2(A1) UC51.6 UC51.12

Not connected (* = marked no-connect by the designer): UC4 23(NC)*

### Notes on the sheet
- SPS  SUPERVISOR
- PWM信号输入高电平有效
- Relay
- INV-A-B-C
- INV-B
- INV-C
- BOOST
- (in symbol IC 239SM, part A) +; -
- (in symbol IC 239SM, part B) +; -
- (in symbol IC 239SM, part C) +; -
- (in symbol IC 239SM, part D) +; -
- (in symbol IC 2903TSM, part A) -; LM2903; SM; +
- (in symbol IC 2903TSM, part B) -; LM2903; SM; +

### Library data of the parts
CC30 CC42 CC179-CC187 CC191-CC193 CC196 CC201 CC204-CC206 CC213-CC215 CC217-CC227 CC231-CC236 CC240-CC247 CC249 CC317 CC350-CC352 CC355 = C0603 SM: 100nF/50V/J/X7R/0603
CC142 CC252 = 023-104320-0 C0603SM: 100nF/50V/J/X7R/0603; Name of Material: 陶瓷电容; Vendor: 三星/YAGEO; Assembly type: 贴片; PN: 023-104320-0
CC198 CC200 CC202 = C0603 SM: 1nF/50V/J/C0G/0603
CC203 CC207-CC209 = CC1206-106/16VSM: 10uF/16V/K/X7R/1206; Part Type: SMD
CC210-CC212 CC228-CC230 CC237-CC239 CC250 CC306 CC307 = C0603 SM: 220pF/50V/J/C0G/0603
CC248 CC348 CC349 = C0603 SM: 10uF/6.3V/K/X7R/0805
CC328-CC343 = CC0805-225/16VSM: 2.2uF/16V/K/X7R/0805; Part Type: SMD
DC31 DC34 DC36 DC39 DC40 = D 1N4148W: 0.15A/75V/SOD-123; Type: 插件
DC32 DC37 DC38 = D S123SM: 0.2A/30V/SOD-123; Type: 贴片
QC4 = 050-210020-0 SOT89: Shunt Regulators/SOT-89; Name of Material: 集成电路; Vendor: BCD; Assembly type: 贴片; PN: 050-210020-0; Factory model: AZ431AR-ATRE1
QC6-QC9 QC14-QC18 QC23-QC26 QC31-QC34 = TR 2222SM: 0.6A/40VDC/SOT-23
QC10-QC13 QC19-QC22 QC27-QC30 QC35-QC38 = TR 2907SM: 0.6A/60VDC/SOT-23
RC27 RC28 RC36 RC40 = 011-103020-0 R0603SM: 10Kohm/1/10W/F/0603; Name of Material: 厚膜电阻; Vendor: RALEC/YAGEO; Factory model: RTT03 10KF TP/RC0603FR-0710KL; Assembly type: 贴片; PN: 011-103020-0
RC148 RC153 RC291 RC293-RC295 RC297 RC299-RC302 RC307 RC308 RC313 RC315 RC318 RC320 RC321 RC323 RC324 RC330-RC333 RC336 RC337 RC340 RC350 RC352 RC353 RC361 RC362 RC364 RC371-RC373 RC381 RC383-RC385 RC510 RC512 RC516 RC517 = R0603SM: 4.7Kohm/1/10W/F/0603
RC154 = R0603SM: 100Kohm/1/10W/F/0603
RC290 RC292 RC296 RC298 RC316 RC317 RC359 RC520-RC531 = R0603SM: 10Kohm/1/10W/F/0603
RC304 RC305 RC309-RC312 RC325-RC328 RC358 RC365 = R0603*4SM: 4.7Kohm/J/0603*4
RC314 RC360 = R0603SM: 1Kohm/1/10W/F/0603
RC322 = R1206SM: 2Kohm/1/4W/F/1206
RC339 = R0603SM: 2.7Kohm/1/10W/F/0603
RC344 = R0603SM: 7.5Kohm/1/10W/F/0603
RC345 = R0603SM: 2.49Kohm/1/10W/F/0603
RC346 = R0603SM: 20Kohm/1/10W/F/0603
RC349 RC363 RC374 RC386 = R0603SM: 5.1Kohm/1/10W/F/0603
RC354-RC357 RC367-RC370 RC376-RC379 RC387-RC390 = R1206SM: 51ohm/1/4W/F/1206
RC366 = R0603SM: 4.99Kohm/1/10W/F/0603
RC518 RC519 = R0603SM_7_1_1_1: 1Kohm/1/10W/F/0603
TP38 = 17K TPD: Type: 插件; Value: NC
UC1-UC3 = SSOP-20: Octal Buffer/Driver/SSOP-20
UC4 = C3245SM: Transceiver/TSSOP-24
UC51 UC52 = 74LS00: Quad 2-Input NAND Gate/SO-14; Value: 74HC00D
UC603 UC610 = 17KSN74LVC06AD: 6-channel inverter buffers/drivers/SOIC-14; Value: SN74HC05D; Type: 贴片
UC604 UC605 = 17K IC SN74LVC07AD: Hex Buffer/Driver/SOIC-14; Type: 贴片
UC606-UC609 = IC 239SM: Quad Differential Comparator/SOIC-14
UC611 UC612 = IC 14081SM: 2-Input AND Gate/SOIC-14
UC614 = IC 2903TSM: Voltage Dual Comparator/SOIC-8; Type: 贴片